# EAGLE design sanguino (EAGLE 6.3)
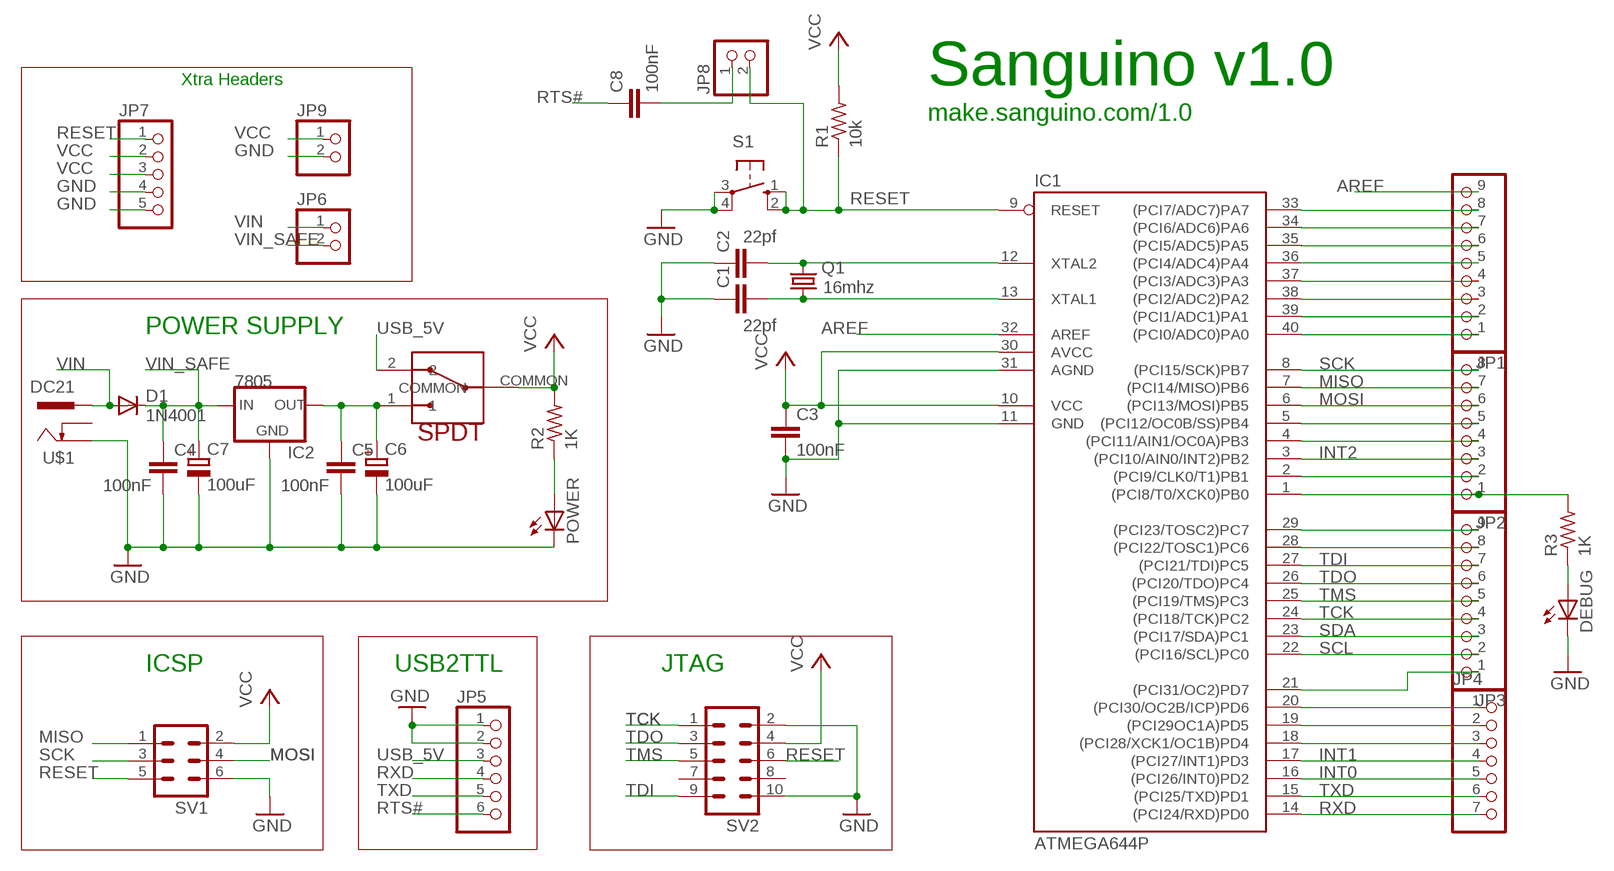
[diagram p0: schematic, sheet 1]

## Parts
C1  22pf  C-EU025-025X050  [C025-025X050]
C2  22pf  C-EU025-025X050  [C025-025X050]
C3  100nF  C-EU050-030X075  [C050-030X075]
C4  100nF  C-EU050-030X075  [C050-030X075]
C5  100nF  C-EU050-030X075  [C050-030X075]
C6  100uF  CPOL-EUE2.5-6  [E2,5-6]
C7  100uF  CPOL-EUE2.5-6  [E2,5-6]
C8  100nF  C-EU050-030X075  [C050-030X075]
D1  1N4001  1N4004  [DO41-10]
DEBUG  LED3MM  [LED3MM]
IC1  ATMEGA644P  ATMEGA644-20P  [DIL40]
IC2  7805  V_REG_78XXSINK  [TO220-IGO]
JP1  PINHD-1X9  [1X09]
JP2  PINHD-1X8  [1X08]
JP3  PINHD-1X9  [1X09]
JP4  PINHD-1X7  [1X07]
JP5  PINHD-1X6  [1X06]
JP6  PINHD-1X2  [1X02]
JP7  PINHD-1X5  [1X05]
JP8  PINHD-1X2  [1X02]
JP9  PINHD-1X2  [1X02]
POWER  LED3MM  [LED3MM]
Q1  16mhz  CRYSTALHC49S  [HC49/S]
R1  10k  R-US_0207/7  [0207/7]
R2  1K  R-US_0207/2V  [0207/2V]
R3  1K  R-US_0207/2V  [0207/2V]
S1  10-XX  [B3F-10XX]
SV1  ML6  [ML6]
SV2  ML10  [ML10]
U$1  DC21  [DCSKT]
U$2  SPDT  [10SP001]

## Nets
AREF: IC1.32(AREF) JP1.9
GND [power]: C1.1 C2.1 C3.2 C4.2 C5.2 C6.- C7.- DEBUG.K(C) IC1.11(GND) IC1.31(AGND) IC2.GND JP5.1 JP5.2 JP7.4 JP7.5 JP9.2 POWER.K(C) S1.3(P) S1.4(P1) SV1.6 SV2.2 SV2.10 U$1.2
INT0: IC1.16((PCI26/INT0)PD2) JP4.5
INT1: IC1.17((PCI27/INT1)PD3) JP4.4
INT2: IC1.3((PCI10/AIN0/INT2)PB2) JP2.3
MISO: IC1.7((PCI14/MISO)PB6) JP2.7 SV1.1
MOSI: IC1.6((PCI13/MOSI)PB5) JP2.6 SV1.4
N$1: C2.2 IC1.12(XTAL2) Q1.2
N$2: IC1.33((PCI7/ADC7)PA7) JP1.8
N$3: IC1.34((PCI6/ADC6)PA6) JP1.7
N$4: POWER.A R2.1
N$5: C1.2 IC1.13(XTAL1) Q1.1
N$6: IC1.35((PCI5/ADC5)PA5) JP1.6
N$7: DEBUG.A R3.1
N$8: IC1.37((PCI3/ADC3)PA3) JP1.4
N$9: IC1.38((PCI2/ADC2)PA2) JP1.3
N$10: IC1.39((PCI1/ADC1)PA1) JP1.2
N$11: IC1.40((PCI0/ADC0)PA0) JP1.1
N$12: IC1.5((PCI12/OC0B/SS)PB4) JP2.5
N$13: IC1.4((PCI11/AIN1/OC0A)PB3) JP2.4
N$15: IC1.2((PCI9/CLK0/T1)PB1) JP2.2
N$16: IC1.1((PCI8/T0/XCK0)PB0) JP2.1 R3.2
N$17: IC1.29((PCI23/TOSC2)PC7) JP3.9
N$18: IC1.28((PCI22/TOSC1)PC6) JP3.8
N$19: IC1.21((PCI31/OC2)PD7) JP3.1
N$20: IC1.36((PCI4/ADC4)PA4) JP1.5
N$21: C8.2 JP8.1
N$22: C5.1 C6.+ IC2.OUT U$2.1
N$26: IC1.20((PCI30/OC2B/ICP)PD6) JP4.1
N$27: IC1.19((PCI29OC1A)PD5) JP4.2
N$28: IC1.18((PCI28/XCK1/OC1B)PD4) JP4.3
RESET: IC1.9(RESET) JP7.1 JP8.2 R1.1 S1.1(S) S1.2(S1) SV1.5 SV2.6
RTS#: C8.1 JP5.6
RXD: IC1.14((PCI24/RXD)PD0) JP4.7 JP5.4
SCK: IC1.8((PCI15/SCK)PB7) JP2.8 SV1.3
SCL: IC1.22((PCI16/SCL)PC0) JP3.2
SDA: IC1.23((PCI17/SDA)PC1) JP3.3
TCK: IC1.24((PCI18/TCK)PC2) JP3.4 SV2.1
TDI: IC1.27((PCI21/TDI)PC5) JP3.7 SV2.9
TDO: IC1.26((PCI20/TDO)PC4) JP3.6 SV2.3
TMS: IC1.25((PCI19/TMS)PC3) JP3.5 SV2.5
TXD: IC1.15((PCI25/TXD)PD1) JP4.6 JP5.5
USB_5V: JP5.3 U$2.2
VCC [power]: C3.1 IC1.10(VCC) IC1.30(AVCC) JP7.2 JP7.3 JP9.1 R1.2 R2.2 SV1.2 SV2.4 U$2.COMMON
VIN [power]: D1.A JP6.1 U$1.1
VIN_SAFE [power]: C4.1 C7.+ D1.C IC2.IN JP6.2
Unconnected: SV2.7 SV2.8 U$1.3

## Notes on the sheet
- Xtra Headers | Sanguino v1.0
- make.sanguino.com/1.0
- POWER SUPPLY
- ICSP | USB2TTL | JTAG

## Library data of the parts
C1-C5 C8 = rcl:C-EU: CAPACITOR, European symbol
C6 C7 = rcl:CPOL-EU: POLARIZED CAPACITOR, European symbol
D1 = diode:1N4004: DIODE general purpose rectifier, 1 A
DEBUG POWER = led:LED: LED OSRAM: - CHIPLED LG R971, LG N971, LY N971, LG Q971, LY Q971, LO R971, LY R971 LH N974, LH R974 LS Q976, LO Q976, LY Q976 LO Q996 - Hyper CHIPLED LW Q18S LB Q993, LB Q99A, LB R99A - SideLED LS A670, LO A670, LY A670, LG A670, LP A670 LB A673, LV A673, LT A673, LW A673 LH A674 LY A675 LS A676, LA A676, LO A676, LY A676, LW A676 LS A679, LY A679, LG A679 - Hyper Micro SIDELED® LS Y876, LA Y876, LO Y876, LY Y876 LT Y87S - SmartLED LW L88C, LW L88S LB L89C, LB L89S, LG L890 LS L89K, LO L89K, LY L89K LS L896, LA L896, LO L896, LY L896 - TOPLED LS T670, LO T670, LY T670, LG T670, LP T670 LSG T670, LSP T670, LSY T670, LOP T670, LYG T670 LG T671, LOG T671, LSG T671 LB T673, LV T673, LT T673, LW T673 LH T674 LS T676, LA T676, LO T676, LY T676, LB T676, LH T676, LSB T676, LW T676 LB T67C, LV T67C, LT T67C, LS T67K, LO T67K, LY T67K, LW E67C LS E67B, LA E67B, LO E67B, LY E67B, LB E67C, LV E67C, LT E67C LW T67C LS T679, LY T679, LG T679 LS T770, LO T770, LY T770, LG T770, LP T770 LB T773, LV T773, LT T773, LW T773 LH T774 LS E675, LA E675, LY E675, LS T675 LS T776, LA T776, LO T776, LY T776, LB T776 LHGB T686 LT T68C, LB T68C - Hyper Mini TOPLED® LB M676 - Mini TOPLED Santana® LG M470 LS M47K, LO M47K, LY M47K Source: http://www.osram.convergy.de - LUMILED® LXK2-PW12-R00, LXK2-PW12-S00, LXK2-PW14-U00, LXK2-PW14-V00 LXK2-PM12-R00, LXK2-PM12-S00, LXK2-PM14-U00 LXK2-PE12-Q00, LXK2-PE12-R00, LXK2-PE12-S00, LXK2-PE14-T00, LXK2-PE14-U00 LXK2-PB12-K00, LXK2-PB12-L00, LXK2-PB12-M00, LXK2-PB14-N00, LXK2-PB14-P00, LXK2-PB14-Q00 LXK2-PR12-L00, LXK2-PR12-M00, LXK2-PR14-Q00, LXK2-PR14-R00 LXK2-PD12-Q00, LXK2-PD12-R00, LXK2-PD12-S00 LXK2-PH12-R00, LXK2-PH12-S00 LXK2-PL12-P00, LXK2-PL12-Q00, LXK2-PL12-R00 Source: www.luxeon.com
IC1 = avr:ATMEGA644*P: MICROCONTROLLER 64 kBytes FLASH 4 kBytes SRAM 2 kBytes EEPROM DUAL USART 8-channel 10 bit ADC
IC2 = SparkFun:V_REG_78XX: Voltage Regulator Standard 7805 5V regulator. IGO (Input Ground Output). Spark Fun Electronics SKU : COM-00107
JP1 JP3 = pinhead:PINHD-1X9: PIN HEADER
JP2 = pinhead:PINHD-1X8: PIN HEADER
JP4 = pinhead:PINHD-1X7: PIN HEADER
JP5 = pinhead:PINHD-1X6: PIN HEADER
JP6 JP8 JP9 = pinhead:PINHD-1X2: PIN HEADER
JP7 = pinhead:PINHD-1X5: PIN HEADER
Q1 = crystal:CRYSTAL: CRYSTAL
R1 R2 = rcl:R-US_: RESISTOR, American symbol
R3 = resistor:R-US_: RESISTOR, American symbol
S1 = switch-omron:10-XX: OMRON SWITCH
SV1 = con-harting-ml:ML6: HARTING
SV2 = con-harting-ml:ML10: HARTING
U$1 = dcsocket:DC21: DC 2.1 mm Power Socket Negative Centre
U$2 = nycr:SPDT

## Net classes
0 default: width 0.635 mm, clearance 0.406 mm
1 power: width 0.635 mm, clearance 0.406 mm

## Board
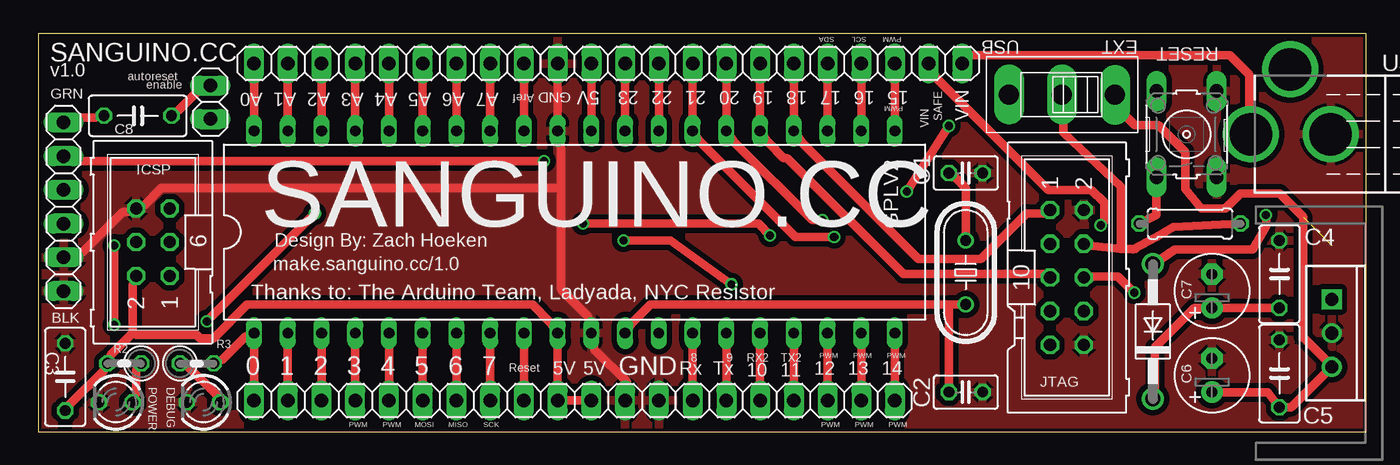
[diagram p1: board, top side]
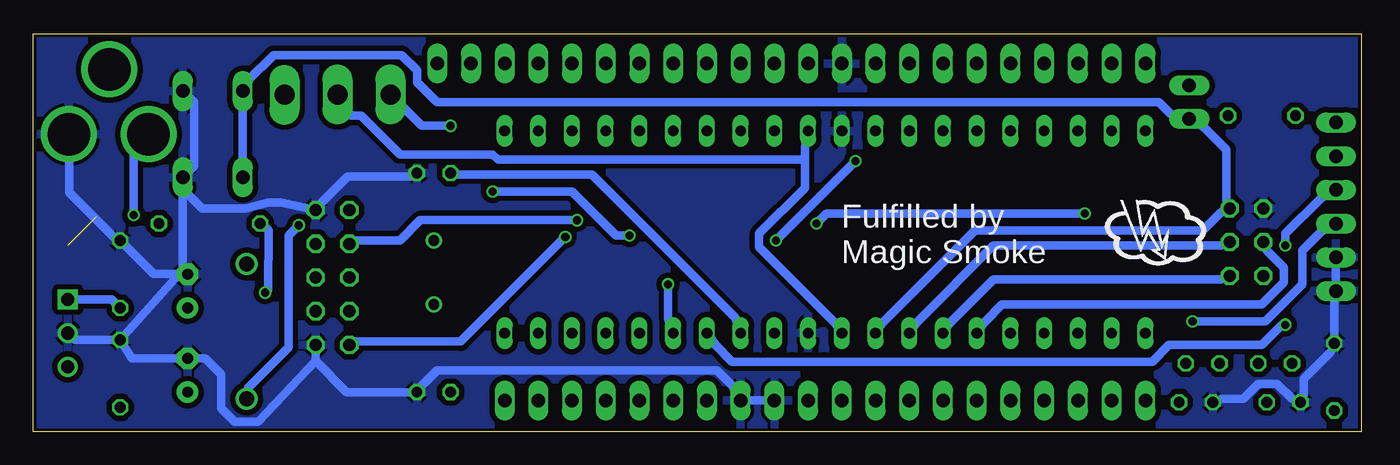
[diagram p2: board, bottom side, seen from below]

Size 100 x 30 mm. Coordinates in mm from the lower left corner, seen from the top.
Outline: 0,0 100,0 100,30 0,30 0,0
Copper layers (1*2*15*16): Top 0.035mm / dielectric 0.2mm / layer 2 0.0175mm / dielectric 1.1mm / layer 15 0.0175mm / dielectric 0.2mm / Bottom 0.035mm
Design rules "SeeedStudio_DRU_no_angle_20130527": minimum track width 6mil, minimum drill 12mil, track to track 6mil, track to pad 6mil, pad to pad 6mil, via to via 6mil, smd to smd 0mil, copper to edge 10mil, drill to drill 10mil, minimum pad ring 6mil, minimum via ring 6mil, stop-mask expansion 2mil, vias tented up to drill 25mil, thermal gap 10mil

### Footprints (pad centres in the part's own frame; a part is rotated, then mirrored left to right if it is on the bottom)
C025-025X050 = drill 0.813 octagon: 1 -1.27,0; 2 1.27,0
C050-030X075 = drill 0.813 octagon: 1 -2.54,0; 2 2.54,0
E2,5-6 = drill 0.813 pad 1.6: + -1.27,0 | drill 0.813 pad 1.6 octagon: - 1.27,0
DO41-10 = drill 1.118: A 5.08,0; C -5.08,0
LED3MM = drill 0.813 octagon: A -1.27,0; K 1.27,0
DIL40 = drill 0.813 long: 1 -24.13,-7.62; 2 -21.59,-7.62; 3 -19.05,-7.62; 4 -16.51,-7.62; 5 -13.97,-7.62; 6 -11.43,-7.62; 7 -8.89,-7.62; 8 -6.35,-7.62; 9 -3.81,-7.62; 10 -1.27,-7.62; 11 1.27,-7.62; 12 3.81,-7.62; 13 6.35,-7.62; 14 8.89,-7.62; 15 11.43,-7.62; 16 13.97,-7.62; 17 16.51,-7.62; 18 19.05,-7.62; 19 21.59,-7.62; 20 24.13,-7.62; 21 24.13,7.62; 22 21.59,7.62; 23 19.05,7.62; 24 16.51,7.62; 25 13.97,7.62; 26 11.43,7.62; 27 8.89,7.62; 28 6.35,7.62; 29 3.81,7.62; 30 1.27,7.62; 31 -1.27,7.62; 32 -3.81,7.62; 33 -6.35,7.62; 34 -8.89,7.62; 35 -11.43,7.62; 36 -13.97,7.62; 37 -16.51,7.62; 38 -19.05,7.62; 39 -21.59,7.62; 40 -24.13,7.62
TO220-IGO = drill 1: GND 0,0; OUT 2.54,0 | drill 1 square: IN -2.54,0
1X09 = drill 1.016 long: 1 -10.16,0; 2 -7.62,0; 3 -5.08,0; 4 -2.54,0; 5 0,0; 6 2.54,0; 7 5.08,0; 8 7.62,0; 9 10.16,0
1X08 = drill 1.016 long: 1 -8.89,0; 2 -6.35,0; 3 -3.81,0; 4 -1.27,0; 5 1.27,0; 6 3.81,0; 7 6.35,0; 8 8.89,0
1X07 = drill 1.016 long: 1 -7.62,0; 2 -5.08,0; 3 -2.54,0; 4 0,0; 5 2.54,0; 6 5.08,0; 7 7.62,0
1X06 = drill 1.016 long: 1 -6.35,0; 2 -3.81,0; 3 -1.27,0; 4 1.27,0; 5 3.81,0; 6 6.35,0
1X02 = drill 1.016 long: 1 -1.27,0; 2 1.27,0
1X05 = drill 1.016 long: 1 -5.08,0; 2 -2.54,0; 3 0,0; 4 2.54,0; 5 5.08,0
HC49/S = drill 0.813: 1 -2.413,0; 2 2.413,0
0207/7 = drill 0.813 octagon: 1 -3.81,0; 2 3.81,0
0207/2V = drill 0.813 octagon: 1 -1.27,0; 2 1.27,0
B3F-10XX = drill 1.016 long: 1 -3.251,2.261; 2 3.251,2.261; 3 -3.251,-2.261; 4 3.251,-2.261
ML6 = drill 0.914 octagon: 1 -2.54,-1.27; 2 -2.54,1.27; 3 0,-1.27; 4 0,1.27; 5 2.54,-1.27; 6 2.54,1.27
ML10 = drill 0.914 octagon: 1 -5.08,-1.27; 2 -5.08,1.27; 3 -2.54,-1.27; 4 -2.54,1.27; 5 0,-1.27; 6 0,1.27; 7 2.54,-1.27; 8 2.54,1.27; 9 5.08,-1.27; 10 5.08,1.27
DCSKT = drill 3.2: 1 0,6.08; 2 0,0.08; 3 4.9,3.13
10SP001 = drill 1.5 long: 1 1.71,2.86; 2 9.69,2.85; COMMON 5.7,2.85

### Placement (x,y rotation side)
C1  69.83,19.5 180 top
C2  69.83,2.98 180 top
C3  2.02,4.13 90 top
C4  93.46,11.88 90 top
C5  93.46,4.38 90 top
C6  88.38,4.25 90 top
C7  88.38,10.61 90 top
C8  7.48,23.81 0 top
D1  83.93,7.56 90 top
DEBUG  12.43,2.22 180 top
IC1  40.37,15.05 0 top
IC2  97.39,7.43 270 top
JP1  26.4,27.75 0 top
JP2  25.13,2.35 0 top
JP3  54.34,27.75 180 top
JP4  56.88,2.35 180 top
JP5  1.89,16.95 90 top
JP6  68.31,27.75 180 top
JP7  41.64,2.35 0 top
JP8  12.94,24.83 270 top
JP9  40.37,27.75 180 top
POWER  5.83,2.22 180 top
Q1  69.83,12 270 top
R1  86.72,15.69 0 top
R2  6.46,5.14 180 top
R3  11.92,5.14 0 top
S1  86.47,22.42 90 top
SV1  8.62,14.29 90 top
SV2  77.45,11.62 270 top
U$1  97.39,22.42 90 top
U$2  82.79,28.26 180 top

### Tracks (layer width: path | path; a pad name or v marks a point on that pad's centre or on a via)
AREF
  Top 0.635: IC1.32 JP1.9
GND
  Top 0.635: JP5.2 3.29,13.53 6.33,16.57 6.71,16.57 SV1.6 7.99,17.08 9.26,18.35 39.35,18.35 | JP9.2 IC1.31 39.35,21.4 39.35,18.35 | JP7.4 44.31,3.75 41.89,6.16 IC1.11 41.39,8.7 39.35,10.73 39.35,18.35
  Bottom 0.635: C1.1 71.48,19.24 76.31,19.24 78.6,16.95 SV2.2 81.33,17.27 82.3,17.27 84.01,16.83 87.27,16.83 88.73,18.29 | DEBUG.K 10.53,2.48 8.87,2.48 7.73,3.62 6.33,3.62 5.19,2.48 POWER.K 4.3,2.86 4.3,4 2.27,6.03 C3.2 2.02,9.97 JP5.1 JP5.2 | JP7.4 JP7.5 47.35,3.49 48.5,4.64 69.58,4.64 70.98,3.24 C2.1 76.39,2.98 78.74,5.33 | C5.2 92.57,5.53 C6.- 87.06,5.53 85.85,4.32 85.85,1.78 84.84,0.76 83.06,0.76 78.74,5.33 | C5.2 96.89,6.92 IC2.GND | 89.01,11.88 C5.2 | 88.73,18.29 88.73,12.23 | 89.01,11.88 90.92,11.88 C4.2 93.66,14.41 97.28,18.03 97.28,22.39 U$1.2 | 78.74,5.33 78.74,6.53 SV2.10 | S1.4 87.88,24.82 87.88,20.01 S1.3 88.73,18.29 | 88.73,12.23 C7.- 89.09,11.88 89.15,11.94 88.39,11.94 | 89.01,11.88 89.01,11.95 88.73,12.23
  pour Bottom: -1.16,31.05 104.5,31.05 104.5,-1.59 -1.16,-1.59
  pour Top: -2.05,31.94 105.39,32.2 105.39,-2.73 -2.3,-2.48
INT0
  Top 0.635: JP4.5 IC1.16
INT1
  Top 0.635: JP4.4 IC1.17
INT2
  Top 0.635: JP2.3 IC1.3
MISO
  Top 0.635: IC1.7 JP2.7
  Bottom 0.635: SV1.1 10.53,11.49 27.67,11.49 30.84,8.32 IC1.7
MOSI
  Top 0.635: IC1.6 JP2.6
  Bottom 0.635: SV1.4 7.1,13.65 5.83,12.38 5.83,11.24 7.48,9.59 27.04,9.59 28.3,8.32 IC1.6
N$1
  Top 0.635: 68.56,9.59 46.09,9.59 44.81,8.32 IC1.12 | 68.56,9.59 Q1.2 | 68.56,9.59 C2.2
N$2
  Top 0.635: IC1.33 JP1.8
N$3
  Top 0.635: IC1.34 JP1.7
N$4
  Top 0.635: POWER.A 7.35,2.86 7.35,4.64 R2.1
N$5
  Top 0.635: Q1.1 69.83,18.35 68.82,19.37 C1.2
  Bottom 0.635: IC1.13 47.1,8.57 57.9,19.37 68.18,19.37 C1.2
N$6
  Top 0.635: IC1.35 JP1.6
N$7
  Top 0.635: R3.1 11.29,4.89 13.45,2.73 DEBUG.A
N$8
  Top 0.635: IC1.37 JP1.4
N$9
  Top 0.635: IC1.38 JP1.3
N$10
  Top 0.635: IC1.39 JP1.2
N$11
  Top 0.635: IC1.40 JP1.1
N$12
  Top 0.635: JP2.5 IC1.5
N$13
  Top 0.635: JP2.4 IC1.4
N$15
  Top 0.635: JP2.2 IC1.2
N$16
  Top 0.635: R3.2 13.83,5.4 15.61,7.18 IC1.1 JP2.1
N$17
  Top 0.635: IC1.29 JP3.9
N$18
  Top 0.635: IC1.28 JP3.8
N$19
  Top 0.635: IC1.21 JP3.1
N$20
  Top 0.635: IC1.36 JP1.5
N$21
  Top 0.635: C8.2 10.53,24.19 11.79,25.46 JP8.1
N$22  (1 unrouted)
  Top 0.635: C6.+ 92.57,2.98 C5.1 94.34,1.84 IC2.OUT 97.39,4.97 95.25,7.11 95.25,16.18 93.47,17.95 90.52,17.95 89.39,16.83 87.57,16.83 86.36,18.29 86.36,21.08 84.33,23.11 82.55,23.11 81.03,24.64 81.03,25.35 U$2.1
N$26
  Top 0.635: JP4.1 IC1.20
N$27
  Top 0.635: JP4.2 IC1.19
N$28
  Top 0.635: JP4.3 IC1.18
RESET  (via drill 0.61)
  Top 0.635: R1.1 84.19,16.32 84.19,18.23 S1.1 | IC1.9 JP7.1 | v82.53,10.48 82.49,10.48 81.28,11.68 78.79,11.68 SV2.6
  Bottom 0.635: v82.53,10.48 82.49,10.48 82.3,10.67 82.28,15.18 82.92,15.81 R1.1 | IC1.9 35.92,8.32 29.07,15.18 11.92,15.18 10.53,16.57 SV1.5 10.14,17.46 10.14,21.27 11.79,22.92 JP8.2 14.34,23.94 15.22,24.83 69.58,24.83 71.1,26.35 71.1,27.24 72.25,28.39 81.9,28.39 83.8,26.48 84.06,26.58 S1.2 S1.1
RTS#
  Top 0.635: C8.1 4.3,23.69 3.29,23.69 JP5.6
RXD  (via drill 0.61)
  Top 0.635: IC1.14 JP4.7 | v5.7,8.06 v5.7,14.03
  Bottom 0.635: v5.7,14.03 5.7,14.92 3.03,17.59 JP5.4 | v5.7,8.06 5.95,8.06 7.48,6.54 14.46,6.54 15.73,5.27 47.35,5.27 48.62,6.54 IC1.14
SCK
  Top 0.635: IC1.8 JP2.8
  Bottom 0.635: SV1.3 10.53,14.03 27.67,14.03 33.38,8.32 IC1.8
SCL
  Top 0.635: IC1.22 JP3.2
SDA
  Top 0.635: IC1.23 JP3.3
TCK
  Top 0.635: JP3.4 IC1.24 57.52,21.78 66.28,13.02 70.98,13.02 74.41,16.45 76.06,16.45 SV2.1
TDI  (via drill 0.61)
  Top 0.635: JP3.7 IC1.27 49.9,21.78 57.01,14.67 v59.93,14.67
  Bottom 0.635: v59.93,14.67 67.8,6.79 76.06,6.79 SV2.9
TDO  (via drill 0.61)
  Top 0.635: JP3.6 IC1.26 52.44,21.78 58.28,15.94 v59.04,15.94
  Bottom 0.635: v59.04,15.94 70.85,15.94 72.37,14.41 76.06,14.41 SV2.3
TMS
  Top 0.635: JP3.5 IC1.25 54.98,21.78 56.12,20.64 56.37,20.64 65.14,11.88 76.06,11.88 SV2.5
TXD  (via drill 0.61)
  Top 0.635: IC1.15 JP4.6 | v38.08,20.38 3.29,20.38 JP5.5 | v44.05,14.41 47.61,14.41 v52.18,11.11
  Bottom 0.635: v38.08,20.38 v44.05,14.41 | v52.18,11.11 52.18,8.57 IC1.15
USB_5V  (via drill 0.61)
  Top 0.635: v12.68,8.32 v20.81,16.45 | v41.01,15.69 54.21,15.69 v55.1,14.8 | v65.39,18.1 v68.56,23.05
  Bottom 0.635: v12.68,8.32 7.22,8.32 4.43,11.11 4.43,13.65 3.03,15.05 JP5.3 | v20.81,16.45 40.24,16.45 v41.01,15.69 | v55.1,14.8 56.12,14.8 59.42,18.1 v65.39,18.1 | v68.56,23.05 70.74,23.05 U$2.2
VCC
  Top 0.635: R1.2 85.45,15.43 84.19,14.67 82.42,13.72 82.61,13.78 81.52,13.78 | 81.52,13.78 79.11,14.03 SV2.4 | U$2.COMMON 77.2,23.69 77.2,22.54 81.52,18.48 81.52,13.78 | C3.1 2.4,2.1 4.94,4.64 R2.2 5.45,5.78 7.1,7.43 | 7.1,7.43 7.1,11.11 SV1.2 | IC1.30 JP9.1 | JP7.3 JP7.2 IC1.10 38.47,8.32 37.2,9.59 15.73,9.59 13.19,7.05 12.18,7.05 11.92,7.3 7.35,7.3 7.1,7.43
  Bottom 0.635: 41.89,20.51 41.89,18.35 45.32,14.92 45.32,13.91 39.73,8.32 IC1.10 | 41.89,20.51 41.89,21.4 IC1.30 | U$2.COMMON 76.06,23.81 75.3,23.81 72.37,20.89 65.39,20.89 65.01,20.51 41.89,20.51
VIN  (via drill 0.61)
  Top 0.635: JP6.1 70.22,28.39 89.72,28.39 91.19,26.92 91.19,22.54 U$1.1 | D1.A 84.01,12.64 85.6,13.72 91.44,13.72 92.46,15.49 92.46,16.05 v92.44,16.32
  Bottom 0.635: v92.44,16.32 92.44,21.29 U$1.1
VIN_SAFE  (via drill 0.61)
  Top 0.635: C4.1 C7.+ 87.06,9.34 84.07,6.35 84.07,2.87 D1.C | JP6.2 67.67,26.61 76.06,18.23 79.31,18.23 80.26,17.27 80.26,15.83 v79.99,15.56
  Bottom 0.635: D1.C 83.82,2.84 83.82,3.3 80.76,6.37 80.76,14.8 v79.99,15.56 | C4.1 94.09,9.97 IC2.IN

### Text on the board
tPlace: SDA | SCL | PWM | USB | EXT | RESET | SANGUINO.CC | v1.0 | autoreset | enable | A0 | A1 | A2 | A3 | A4 | A5 | A6 | A7 | GND | 5V | 23 | 22 | 21 | 20 | 19 | 18 | 17 | 16 | 15 | GRN | Aref | PWM | VIN | SAFE | VIN | ICSP | SANGUINO.CC | GPLV2 | Design By: Zach Hoeken | make.sanguino.cc/1.0 | Thanks to: The Arduino Team, Ladyada, NYC Resistor | BLK | C3 | PWM | PWM | PWM | Reset | 8 | 9 | RX2 | TX2 | 0 | 1 | 2 | 3 | 4 | 5 | 6 | 7 | 5V | 5V | GND | Rx | Tx | 10 | 11 | 12 | 13 | 14 | JTAG | PWM | PWM | MOSI | MISO | SCK | PWM | PWM | PWM
bPlace: Fulfilled by / Magic Smoke